# Altium schematic sheet power_delivery.SchDoc
size 297 x 209 mm
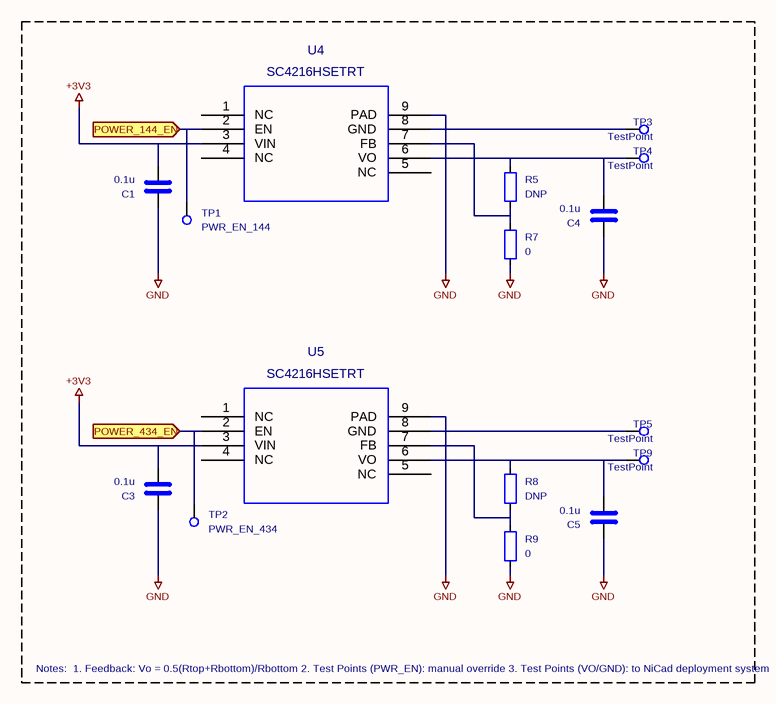
[diagram p0: power_delivery.SchDoc]

## Parts
C1  0.1u  [C_0603_1608Metric]
C3  0.1u  [C_0603_1608Metric]
C4  0.1u  [C_0603_1608Metric]
C5  0.1u  [C_0603_1608Metric]
R5  DNP  [R_0603_1608Metric_Pad0.98x0.95mm_HandSolder]
R7  0  [R_0603_1608Metric_Pad0.98x0.95mm_HandSolder]
R8  DNP  [R_0603_1608Metric_Pad0.98x0.95mm_HandSolder]
R9  0  [R_0603_1608Metric_Pad0.98x0.95mm_HandSolder]
TP1  PWR_EN_144  [TestPoint_THTPad_4.0x4.0mm_Drill2.0mm]
TP2  PWR_EN_434  [TestPoint_THTPad_4.0x4.0mm_Drill2.0mm]
TP3  TestPoint  [TestPoint_THTPad_4.0x4.0mm_Drill2.0mm]
TP4  TestPoint  [TestPoint_THTPad_4.0x4.0mm_Drill2.0mm]
TP5  TestPoint  [TestPoint_THTPad_4.0x4.0mm_Drill2.0mm]
TP9  TestPoint  [TestPoint_THTPad_4.0x4.0mm_Drill2.0mm]
U4  SC4216HSETRT  [SOIC-8-1EP_3.9x4.9mm_P1.27mm_EP2.29x3mm]
U5  SC4216HSETRT  [SOIC-8-1EP_3.9x4.9mm_P1.27mm_EP2.29x3mm]

## Ports
POWER_144_EN (in), POWER_434_EN (in)

## Nets
+3V3: C1.2 C3.2 U4.3(VIN) U5.3(VIN)
GND: C1.1 C3.1 C4.1 C5.1 R7.2 R9.2 TP3.1 TP5.1 U4.8(GND) U4.9(PAD) U5.8(GND) U5.9(PAD)
POWER_144_EN: TP1.1 U4.2(EN) ; port POWER_144_EN
POWER_434_EN: TP2.1 U5.2(EN) ; port POWER_434_EN
NetC4_2: C4.2 R5.1 TP4.1 U4.6(VO)
NetC5_2: C5.2 R8.1 TP9.1 U5.6(VO)
NetR5_2: R5.2 R7.1 U4.7(FB)
NetR8_2: R8.2 R9.1 U5.7(FB)

Not connected (* = marked no-connect by the designer): U4 1(NC) 4(NC) 5(NC); U5 1(NC) 4(NC) 5(NC)

## Notes on the sheet
- Notes:
  1. Feedback: Vo = 0.5(Rtop+Rbottom)/Rbottom
  2. Test Points (PWR_EN): manual override
  3. Test Points (VO/GND): to NiCad deployment system
- 1
- 2
- 3
- 4
- 5
- 6
- A
- B
- C
- D
- Title: Antenna Deployment Board
- File: power_delivery.kicad_sch
- Sheet: /
- Queen's Space Engineering Team - Satellite
- KiCad E.D.A.  kicad (5.1.4)-1
- Size: A4
- Date: 2023-04-24
- Rev: RevA
- Id: 1/1

## Library data of the parts
C1 C3-C5 = C: Value: 0.1u; Footprint: Capacitor_SMD:C_0603_1608Metric
R5 R7-R9 = R: Footprint: Resistor_SMD:R_0603_1608Metric_Pad0.98x0.95mm_HandSolder
  R5 R8: Value: DNP
  R7 R9: Value: 0
TP1 TP2 = TestPoint: Footprint: TestPoint:TestPoint_THTPad_4.0x4.0mm_Drill2.0mm
  TP1: Value: PWR_EN_144
  TP2: Value: PWR_EN_434
TP3-TP5 TP9 = TestPoint: Value: TestPoint; Footprint: TestPoint:TestPoint_THTPad_4.0x4.0mm_Drill2.0mm
U4 U5 = SC4216HSETRT: Value: SC4216HSETRT; Footprint: Package_SO:SOIC-8-1EP_3.9x4.9mm_P1.27mm_EP2.29x3mm